# Altium project attiny202_l9110.PrjPcb
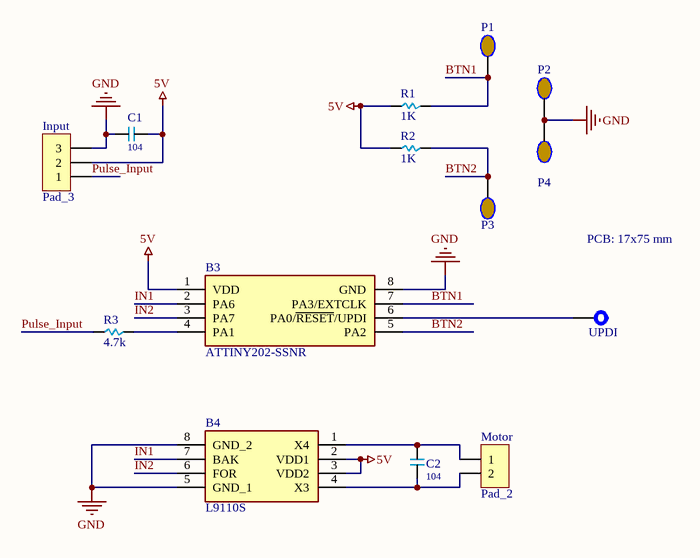
[diagram p0: sche.SchDoc]
1 sheet, 14 parts. Net scope: global (net labels, ports and power ports of the same name join across sheets).
Board files: pcb.PcbDoc, PCB1-v2.PcbDoc

## Sheet sche.SchDoc
size A4; SheetNumber: 1; SheetTotal: 1

### Parts
B3  ATTINY202-SSNR  [SOIC127P600X175-8N]
B4  L9110S  [SOIC127P600X175-8N]
C1  104  [CAP 0603]
C2  104  [CAP 0603]
Input  Pad_3  [Pad_3_2.54]
Motor  Pad_2  [PAD_2_2.54]
P1  Pad_1  [Pad_1]  (value not drawn)
P2  Pad_1  [Pad_1]  (value not drawn)
P3  Pad_1  [Pad_1]  (value not drawn)
P4  Pad_1  [Pad_1]  (value not drawn)
R1  1K  [RES 0603]
R2  1K  [RES 0603]
R3  4.7k  [RES 0603]
UPDI  TEST  [TEST]  (value not drawn)

### Nets
5V: B3.1(VDD) B4.2(VDD1) B4.3(VDD2) C1.1 Input.2 R1.1 R2.1
GND: B3.8(GND) B4.5(GND_1) B4.8(GND_2) C1.2 Input.3 P2.1 P4.1
BTN1: B3.7(PA3/EXTCLK) P1.1 R1.2
BTN2: B3.5(PA2) P3.1 R2.2
IN1: B3.2(PA6) B4.7(BAK)
IN2: B3.3(PA7) B4.6(FOR)
Pulse_Input: Input.1 R3.1
NetB3_4: B3.4(PA1) R3.2
NetB3_6: B3.6(PA0/~{RESET}/UPDI) UPDI.1
NetB4_1: B4.1(X4) C2.1 Motor.1
NetB4_4: B4.4(X3) C2.2 Motor.2

### Notes on the sheet
- PCB: 17x75 mm

### Library data of the parts
B3 = ATTINY202-SSNR: 8-bit Microcontrollers - MCU 20MHz, 2KB, SOIC8, Ind 105C, Green, T&R; Manufacturer_Name: Microchip; Geometry.Height: 1.75mm; Manufacturer_Part_Number: ATTINY202-SSNR; Mouser Part Number: 579-ATTINY202-SSNR; Mouser Price/Stock: https://www.mouser.co.uk/ProductDetail/Microchip-Technology/ATTINY202-SSNR?qs=y6ZabgHbY%252Bx90fzudZ0SuA%3D%3D; Arrow Part Number: ATTINY202-SSNR; Arrow Price/Stock: https://www.arrow.com/en/products/attiny202-ssnr/microchip-technology?utm_currency=USD&region=nac; Datasheet Link: http://ww1.microchip.com/downloads/en/DeviceDoc/ATtiny202-402-AVR-MCU-with-Core-Independent-Peripherals_and-picoPower-40001969A.pdf
B4 = L9110S: Motor Drivers SOP-8_150mil RoHS; Manufacturer_Name: Wuxi I-core Elec; Geometry.Height: 1.75mm; Manufacturer_Part_Number: L9110S; Mouser Part Number: *; Mouser Price/Stock: *; Arrow Part Number: *; Arrow Price/Stock: *; Datasheet Link: https://datasheet.lcsc.com/szlcsc/Wuxi-Zhongwei-Aisin-Elec-L9110S_C85174.pdf
C1 C2 = CAP: Value: 104
R1-R3 = RES
  R1 R2: Value: 1K
  R3: Value: 4.7k
UPDI = Test_Point